# EAGLE schematic Schematic (EAGLE 9.3.0)

## Sheet 1 of 2
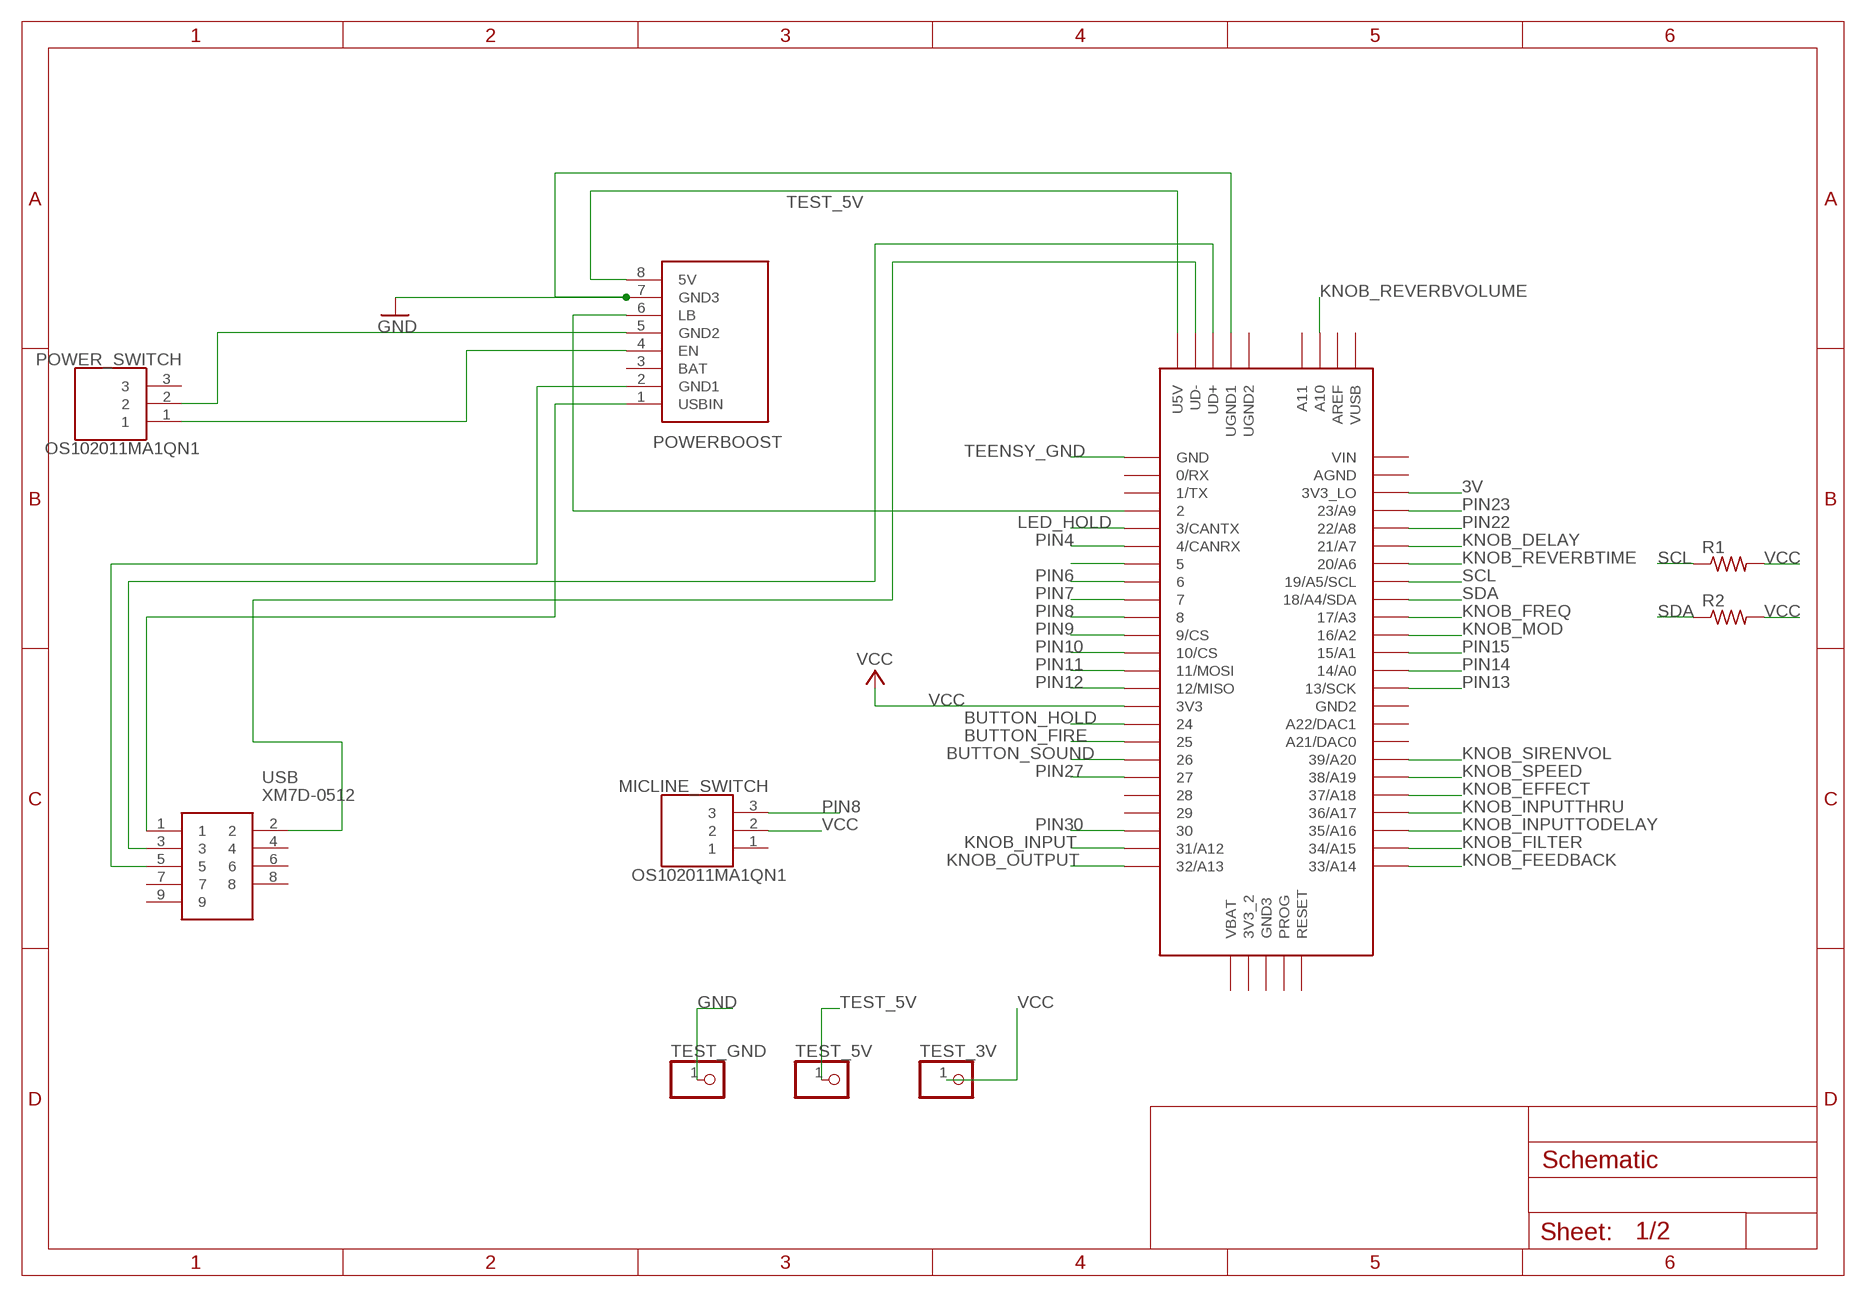
[diagram p0: schematic, sheet 1, part 1 of 2]
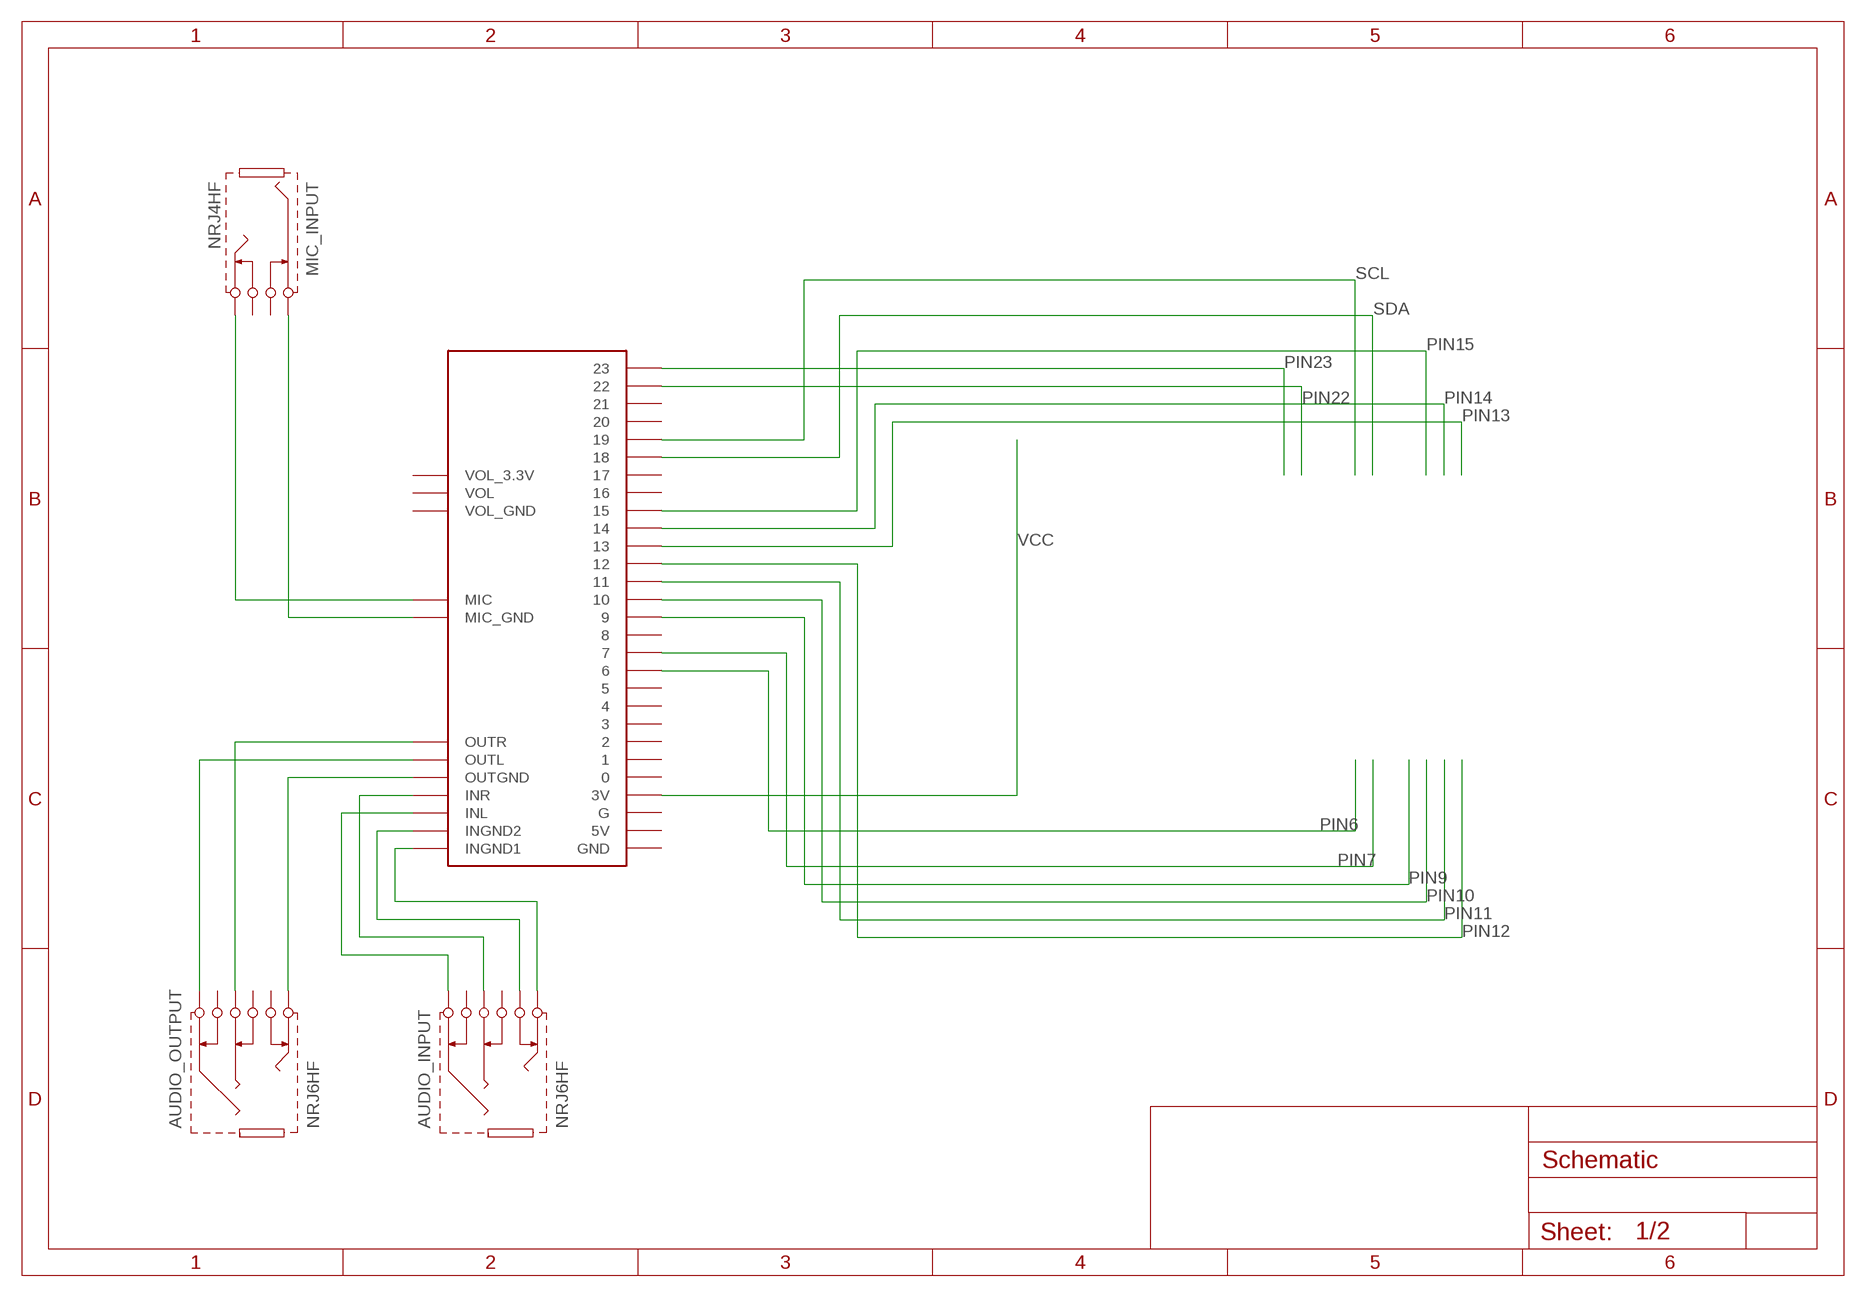
[diagram p1: schematic, sheet 1, part 2 of 2]

### Parts
AUDIO_INPUT  NRJ6HF  [NRJ6HF]
AUDIO_OUTPUT  NRJ6HF  [NRJ6HF]
MIC_INPUT  NRJ4HF  [NRJ4HF]
MICLINE_SWITCH  OS102011MA1QN1  [OS102011MA1QN1]
POWER_SWITCH  OS102011MA1QN1  [OS102011MA1QN1]
R1  R-US_0207/10  [0207/10]
R2  R-US_0207/10  [0207/10]
TEENSY  TEENSY_3.5/3.6  [TEENSY_3.5/3.6]
TEST_3V  PINHD-1X1  [1X01]
TEST_5V  PINHD-1X1  [1X01]
TEST_GND  PINHD-1X1  [1X01]
U$2  POWERBOOST500C  [POWERBOOST500]
U$5  AUDIOSHIELD  [AUDIOSHIELD]
USB  XM7D-0512  [XM7D0512]

### Nets
3V: TEENSY.3V3_LO
BUTTON_FIRE: TEENSY.25 ; also sheet 2
BUTTON_HOLD: TEENSY.24 ; also sheet 2
BUTTON_SOUND: TEENSY.26 ; also sheet 2
GND: TEENSY.UGND1 TEST_GND.1 U$2.7(GND3) ; also sheet 2
KNOB_DELAY: TEENSY.21/A7 ; also sheet 2
KNOB_EFFECT: TEENSY.37/A18 ; also sheet 2
KNOB_FEEDBACK: TEENSY.33/A14 ; also sheet 2
KNOB_FILTER: TEENSY.34/A15 ; also sheet 2
KNOB_FREQ: TEENSY.17/A3 ; also sheet 2
KNOB_INPUT: TEENSY.31/A12 ; also sheet 2
KNOB_INPUTTHRU: TEENSY.36/A17 ; also sheet 2
KNOB_INPUTTODELAY: TEENSY.35/A16 ; also sheet 2
KNOB_MOD: TEENSY.16/A2 ; also sheet 2
KNOB_OUTPUT: TEENSY.32/A13 ; also sheet 2
KNOB_REVERBTIME: TEENSY.20/A6 ; also sheet 2
KNOB_REVERBVOLUME: TEENSY.A10 ; also sheet 2
KNOB_SIRENVOL: TEENSY.39/A20 ; also sheet 2
KNOB_SPEED: TEENSY.38/A19 ; also sheet 2
LED_HOLD: TEENSY.3/CANTX ; also sheet 2
N$1: U$2.1(USBIN) USB.1
N$2: U$2.2(GND1) USB.5
N$3: TEENSY.UD- USB.2
N$4: TEENSY.UD+ USB.3
N$5: MIC_INPUT.SLEEVE U$5.GND_MIC(MIC_GND)
N$6: MIC_INPUT.TIP U$5.MIC
N$8: AUDIO_OUTPUT.TIP U$5.OUTGND
N$9: AUDIO_INPUT.SLEEVE U$5.INL
N$10: AUDIO_OUTPUT.RING U$5.OUTR
N$11: AUDIO_INPUT.TIP U$5.INGND1
N$12: AUDIO_INPUT.TIP-S U$5.INGND2
N$13: AUDIO_INPUT.RING U$5.INR
N$14: AUDIO_OUTPUT.SLEEVE U$5.OUTL
N$15: TEENSY.2 U$2.6(LB)
N$16: POWER_SWITCH.1 U$2.4(EN)
N$17: POWER_SWITCH.2 U$2.5(GND2)
PIN4: TEENSY.4/CANRX ; also sheet 2
PIN5: TEENSY.5 ; also sheet 2
PIN6: TEENSY.6 U$5.6
PIN7: TEENSY.7 U$5.7
PIN8: MICLINE_SWITCH.3 TEENSY.8
PIN9: TEENSY.9/CS U$5.9
PIN10: TEENSY.10/CS U$5.10
PIN11: TEENSY.11/MOSI U$5.11
PIN12: TEENSY.12/MISO U$5.12
PIN13: TEENSY.13/SCK U$5.13
PIN14: TEENSY.14/A0 U$5.14
PIN15: TEENSY.15/A1 U$5.15
PIN22: TEENSY.22/A8 U$5.22
PIN23: TEENSY.23/A9 U$5.23
PIN27: TEENSY.27 ; also sheet 2
PIN30: TEENSY.30 ; also sheet 2
SCL: R1.1 TEENSY.19/A5/SCL U$5.19 ; also sheet 2
SDA: R2.1 TEENSY.18/A4/SDA U$5.18 ; also sheet 2
TEENSY_GND: TEENSY.GND
TEST_5V: TEENSY.U5V TEST_5V.1 U$2.8(5V)
VCC: MICLINE_SWITCH.2 R1.2 R2.2 TEENSY.3V3 TEST_3V.1 U$5.3V ; also sheet 2
Unconnected: AUDIO_INPUT.RING-S AUDIO_INPUT.SLEEVE-S AUDIO_OUTPUT.RING-S AUDIO_OUTPUT.SLEEVE-S AUDIO_OUTPUT.TIP-S MIC_INPUT.SLEEVE-S MIC_INPUT.TIP-S MICLINE_SWITCH.1 POWER_SWITCH.3 TEENSY.0/RX TEENSY.1/TX TEENSY.3V3_2 TEENSY.21/DAC0(A21/DAC0) TEENSY.28 TEENSY.29 TEENSY.A11 TEENSY.A22/DAC1 TEENSY.AGND TEENSY.AREF TEENSY.GND2 TEENSY.GND3 TEENSY.PROG TEENSY.RESET TEENSY.UGND2 TEENSY.VBAT TEENSY.VIN TEENSY.VUSB U$2.3(BAT) U$5.0 U$5.1 U$5.2 U$5.3 U$5.4 U$5.5 U$5.5V U$5.8 U$5.16 U$5.17 U$5.20 U$5.21 U$5.G U$5.GND U$5.VOL U$5.VOL_3.3V U$5.VOL_GND USB.4 USB.6 USB.7 USB.8 USB.9

## Sheet 2 of 2
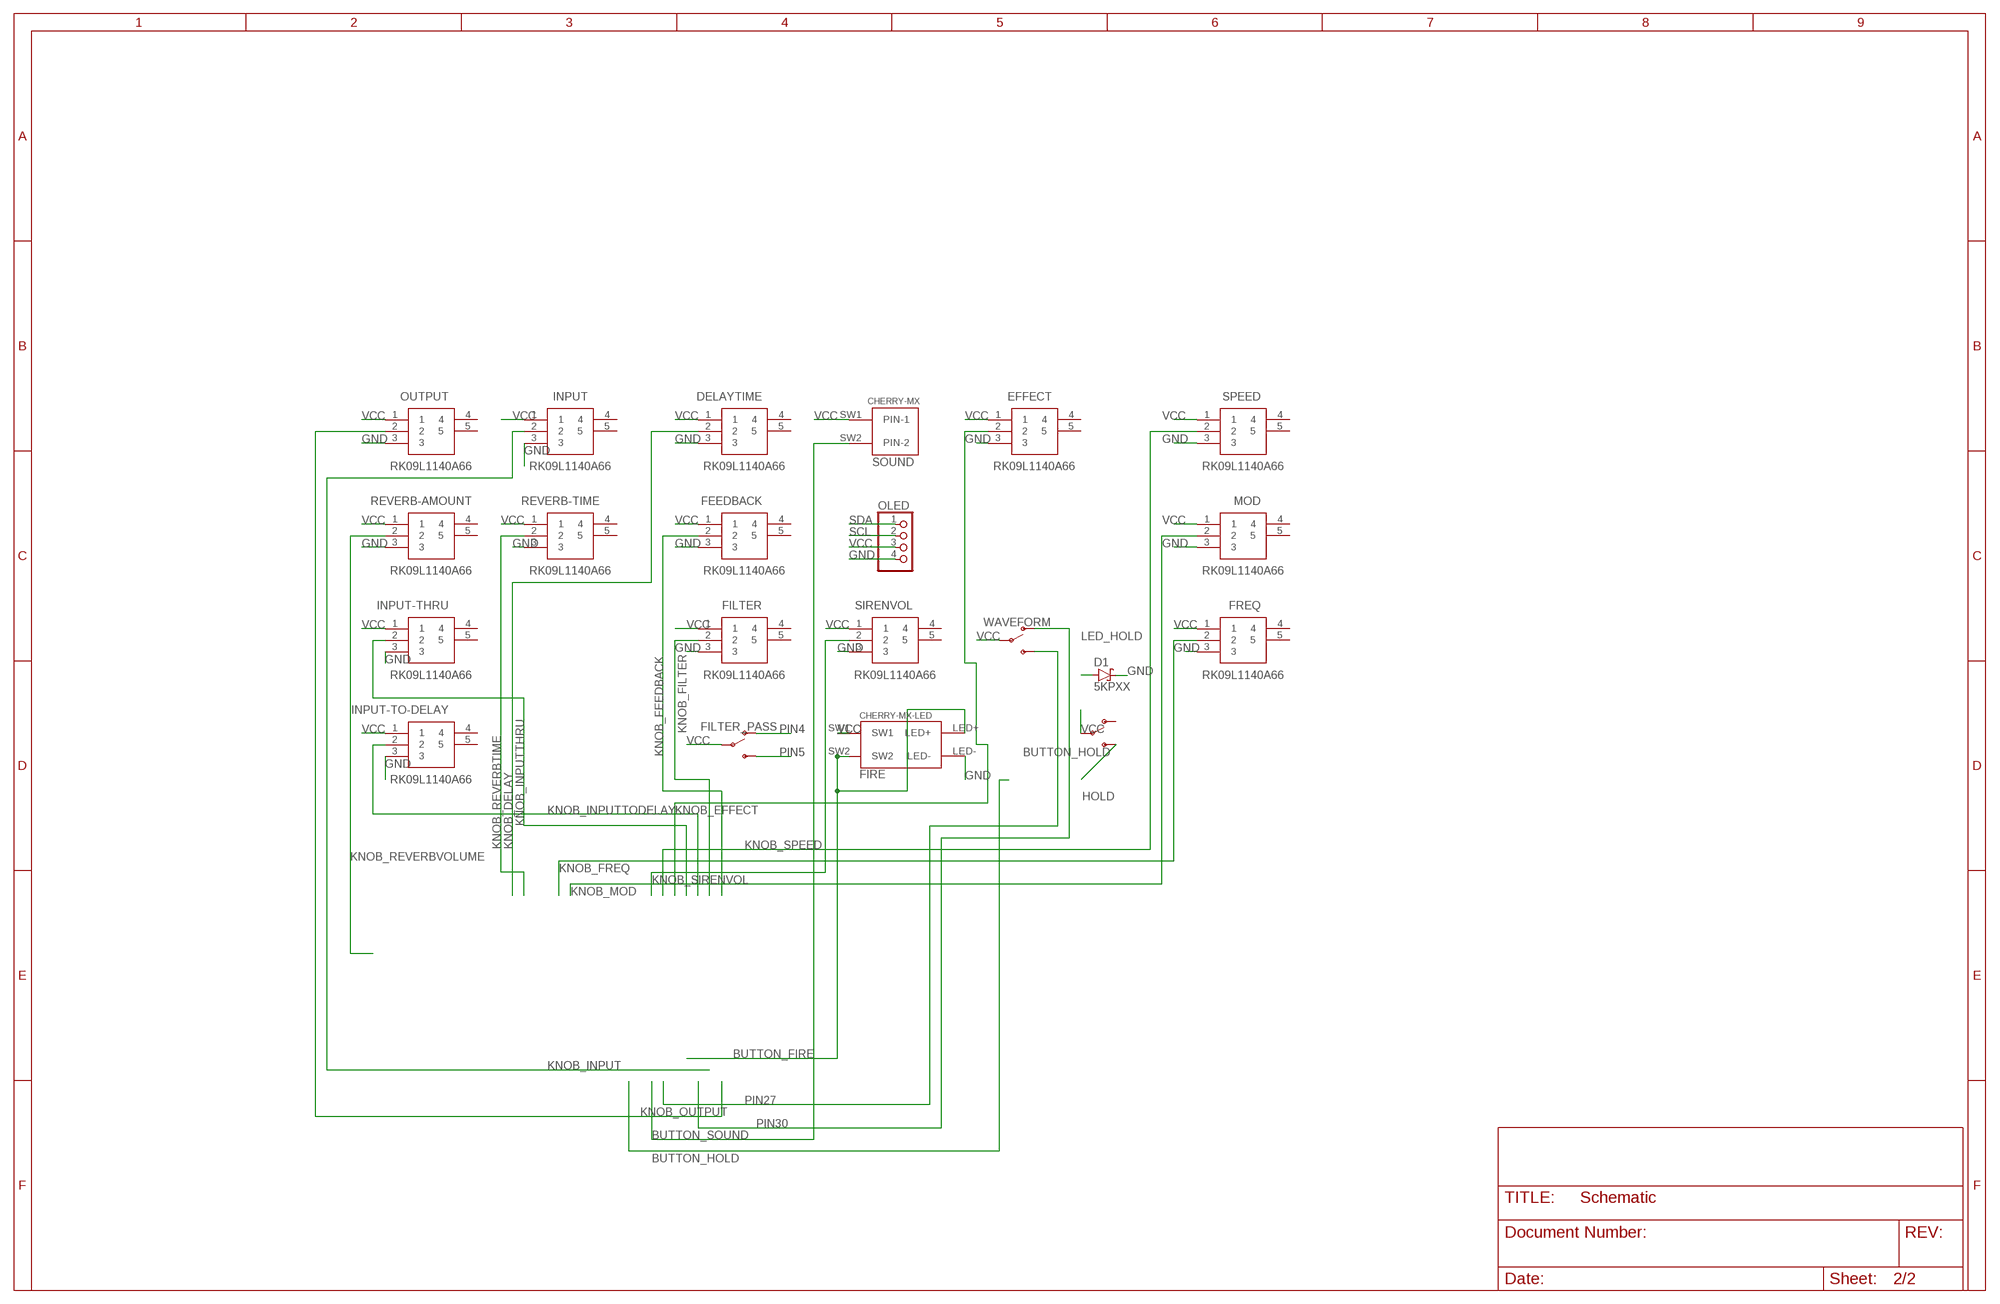
[diagram p2: schematic, sheet 2]

### Parts
D1  5KPXX  [P6T15]
DELAYTIME  RK09L1140A66  [RK09L1140A66]
EFFECT  RK09L1140A66  [RK09L1140A66]
FEEDBACK  RK09L1140A66  [RK09L1140A66]
FILTER  RK09L1140A66  [RK09L1140A66]
FILTER_PASS  SWITCH-SPDT-PTH-11.6X4.0MM-LOCK  [SWITCH_SPDT_PTH_11.6X4.0MM_LOCK]
FIRE  CHERRY-MX-LED  [CHERRY-MX-LED]
FREQ  RK09L1140A66  [RK09L1140A66]
HOLD  SWITCH-SPDT-PTH-11.6X4.0MM-LOCK  [SWITCH_SPDT_PTH_11.6X4.0MM_LOCK]
INPUT  RK09L1140A66  [RK09L1140A66]
INPUT-THRU  RK09L1140A66  [RK09L1140A66]
INPUT-TO-DELAY  RK09L1140A66  [RK09L1140A66]
MOD  RK09L1140A66  [RK09L1140A66]
OLED  PINHD-1X4  [1X04]
OUTPUT  RK09L1140A66  [RK09L1140A66]
REVERB-AMOUNT  RK09L1140A66  [RK09L1140A66]
REVERB-TIME  RK09L1140A66  [RK09L1140A66]
SIRENVOL  RK09L1140A66  [RK09L1140A66]
SOUND  CHERRY-MX  [CHERRY-MX]
SPEED  RK09L1140A66  [RK09L1140A66]
WAVEFORM  SWITCH-SPDT-PTH-11.6X4.0MM-LOCK  [SWITCH_SPDT_PTH_11.6X4.0MM_LOCK]

### Nets
BUTTON_FIRE: FIRE.LED+ FIRE.SW2 ; also sheet 1
BUTTON_HOLD: HOLD.3(S) ; also sheet 1
BUTTON_SOUND: SOUND.SW2(PIN-2) ; also sheet 1
GND: D1.C DELAYTIME.3 EFFECT.3 FEEDBACK.3 FILTER.3 FIRE.LED- FREQ.3 INPUT-THRU.3 INPUT-TO-DELAY.3 INPUT.3 MOD.3 OLED.4 OUTPUT.3 REVERB-AMOUNT.3 REVERB-TIME.3 SIRENVOL.3 SPEED.3 ; also sheet 1
KNOB_DELAY: DELAYTIME.2 ; also sheet 1
KNOB_EFFECT: EFFECT.2 ; also sheet 1
KNOB_FEEDBACK: FEEDBACK.2 ; also sheet 1
KNOB_FILTER: FILTER.2 ; also sheet 1
KNOB_FREQ: FREQ.2 ; also sheet 1
KNOB_INPUT: INPUT.2 ; also sheet 1
KNOB_INPUTTHRU: INPUT-THRU.2 ; also sheet 1
KNOB_INPUTTODELAY: INPUT-TO-DELAY.2 ; also sheet 1
KNOB_MOD: MOD.2 ; also sheet 1
KNOB_OUTPUT: OUTPUT.2 ; also sheet 1
KNOB_REVERBTIME: REVERB-TIME.2 ; also sheet 1
KNOB_REVERBVOLUME: REVERB-AMOUNT.2 ; also sheet 1
KNOB_SIRENVOL: SIRENVOL.2 ; also sheet 1
KNOB_SPEED: SPEED.2 ; also sheet 1
LED_HOLD: D1.A ; also sheet 1
PIN4: FILTER_PASS.1(O) ; also sheet 1
PIN5: FILTER_PASS.3(S) ; also sheet 1
PIN27: WAVEFORM.3(S) ; also sheet 1
PIN30: WAVEFORM.1(O) ; also sheet 1
SCL: OLED.2 ; also sheet 1
SDA: OLED.1 ; also sheet 1
VCC: DELAYTIME.1 EFFECT.1 FEEDBACK.1 FILTER.1 FILTER_PASS.2(P) FIRE.SW1 FREQ.1 HOLD.2(P) INPUT-THRU.1 INPUT-TO-DELAY.1 INPUT.1 MOD.1 OLED.3 OUTPUT.1 REVERB-AMOUNT.1 REVERB-TIME.1 SIRENVOL.1 SOUND.SW1(PIN-1) SPEED.1 WAVEFORM.2(P) ; also sheet 1
Unconnected: DELAYTIME.4 DELAYTIME.5 EFFECT.4 EFFECT.5 FEEDBACK.4 FEEDBACK.5 FILTER.4 FILTER.5 FREQ.4 FREQ.5 HOLD.1(O) INPUT-THRU.4 INPUT-THRU.5 INPUT-TO-DELAY.4 INPUT-TO-DELAY.5 INPUT.4 INPUT.5 MOD.4 MOD.5 OUTPUT.4 OUTPUT.5 REVERB-AMOUNT.4 REVERB-AMOUNT.5 REVERB-TIME.4 REVERB-TIME.5 SIRENVOL.4 SIRENVOL.5 SPEED.4 SPEED.5

## Library data of the parts
AUDIO_INPUT AUDIO_OUTPUT = audio:NRJ6HF: Neutrik 1/4" Stereo Phone Connector
D1 = diode:5KPXX: DIODE transient voltage suppressor
DELAYTIME EFFECT FEEDBACK FILTER FREQ INPUT INPUT-THRU INPUT-TO-DELAY MOD OUTPUT REVERB-AMOUNT REVERB-TIME SIRENVOL SPEED = SamacSys_Parts:RK09L1140A66: Audio potentiometer 10K Vertical 12,5mm Source: Datasheet <https://componentsearchengine.com/Datasheets/1/RK09L1140A66.pdf>; DESCRIPTION: Audio potentiometer 10K Vertical 12,5mm; HEIGHT: 22mm; MANUFACTURER_NAME: ALPS; MANUFACTURER_PART_NUMBER: RK09L1140A66; MOUSER_PART_NUMBER: 688-RK09L1140A66
FILTER_PASS HOLD WAVEFORM = SparkFun-Switches:SWITCH-SPDT: Single Pole, Double Throw (SPDT) Switch Single-pole, double-throw (SPDT) switch. Variant Overview SMD-AYZ0202 Surface Mount DPDT Switch <https://www.sparkfun.com/products/597> (COM-00597) Used on e.g. LilyPad Arduino USB - ATmega32U4 Board <https://www.sparkfun.com/products/12049> PTH-11.6X4.0MM SPDT Mini Power Switch <https://www.sparkfun.com/products/102> (COM-00102) Used on e.g. SparkFun Simon Says - Through-Hole Soldering Kit <https://www.sparkfun.com/products/10547> (KIT-10547) PTH-11.6X4.0MM-KIT KIT version of SPDT Mini Power Switch - Simplifies soldering by removing tStop of switch pins - only one side can be soldered. PTH-11.6X4.0MM-LOCK LOCK version of SPDT Mini Power Switch - Offset pins hold switch in place for easier soldering. SMD-RIGHT-ANGLE Surface Mount Right Angle Switch <https://www.sparkfun.com/products/10860> (COM-10860) Used on e.g. SparkFun ESP8266 Thing <https://www.sparkfun.com/products/13231>; PROD_ID: SWCH-08261; SF_SKU: COM-00102
FIRE = cherrymx:CHERRY-MX-LED: Cherry MX series keyswitch with LED
MIC_INPUT = audio:NRJ4HF: Neutrik 1/4" Mono Phone Connector
MICLINE_SWITCH POWER_SWITCH = OS102011MA1QN1:OS102011MA1QN1: Switch Slide Right Angle SPDT 0.1A 12VDC Through Hole Slide Switch SPDT On-On 0.1 A@ 12 V dc Slide Source: Datasheet <http://www.ckswitches.com/media/1428/os.pdf>; ALLIED_NUMBER: 70128246; ALLIED_PRICE-STOCK: https://www.alliedelec.com/c-k-os102011ma1qn1/70128246/; DESCRIPTION: Switch Slide Right Angle SPDT 0.1A 12VDC Through Hole Slide Switch SPDT On-On 0.1 A@ 12 V dc Slide; HEIGHT: mm; MANUFACTURER_NAME: C & K COMPONENTS; MANUFACTURER_PART_NUMBER: OS102011MA1QN1; MOUSER_PART_NUMBER: 611-OS102011MA1QN1; MOUSER_PRICE-STOCK: https://www.mouser.com/Search/Refine.aspx?Keyword=611-OS102011MA1QN1; RS_PART_NUMBER: 7874855; RS_PRICE-STOCK: http://uk.rs-online.com/web/p/products/7874855
OLED = pinhead:PINHD-1X4: PIN HEADER
R1 R2 = resistor:R-US_: RESISTOR, American symbol
SOUND = cherrymx:CHERRY-MX: Cherry MX series keyswitch
TEENSY = Teensy356:TEENSY_3.5/3.6
TEST_3V TEST_5V TEST_GND = pinhead:PINHD-1X1: PIN HEADER
U$2 = jos-ph:POWERBOOST500C: Adafruit PowerBoost 500c https://www.adafruit.com/products/1944 *UNPROVEN*
U$5 = Teensy_Audioshield:AUDIOSHIELD: Teensy 3 Audioshield by PJRC.COM
USB = SamacSys_Parts:XM7D-0512: OMRON ELECTRONIC COMPONENTS - XM7D-0512 - MINI USB, 2.0 TYPE B, RECEPTACLE, TH Source: Datasheet <https://componentsearchengine.com/Datasheets/1/XM7D-0512.pdf>; DESCRIPTION: OMRON ELECTRONIC COMPONENTS - XM7D-0512 - MINI USB, 2.0 TYPE B, RECEPTACLE, TH; HEIGHT: 3mm; MANUFACTURER_NAME: Omron Electronics; MANUFACTURER_PART_NUMBER: XM7D-0512; MOUSER_PART_NUMBER: 653-XM7D-0512

## Net classes
0 default: width 0.254 mm, drill 0.686 mm, clearance 0.254 mm